# EAGLE schematic Nu_Preamp (EAGLE 6.3)
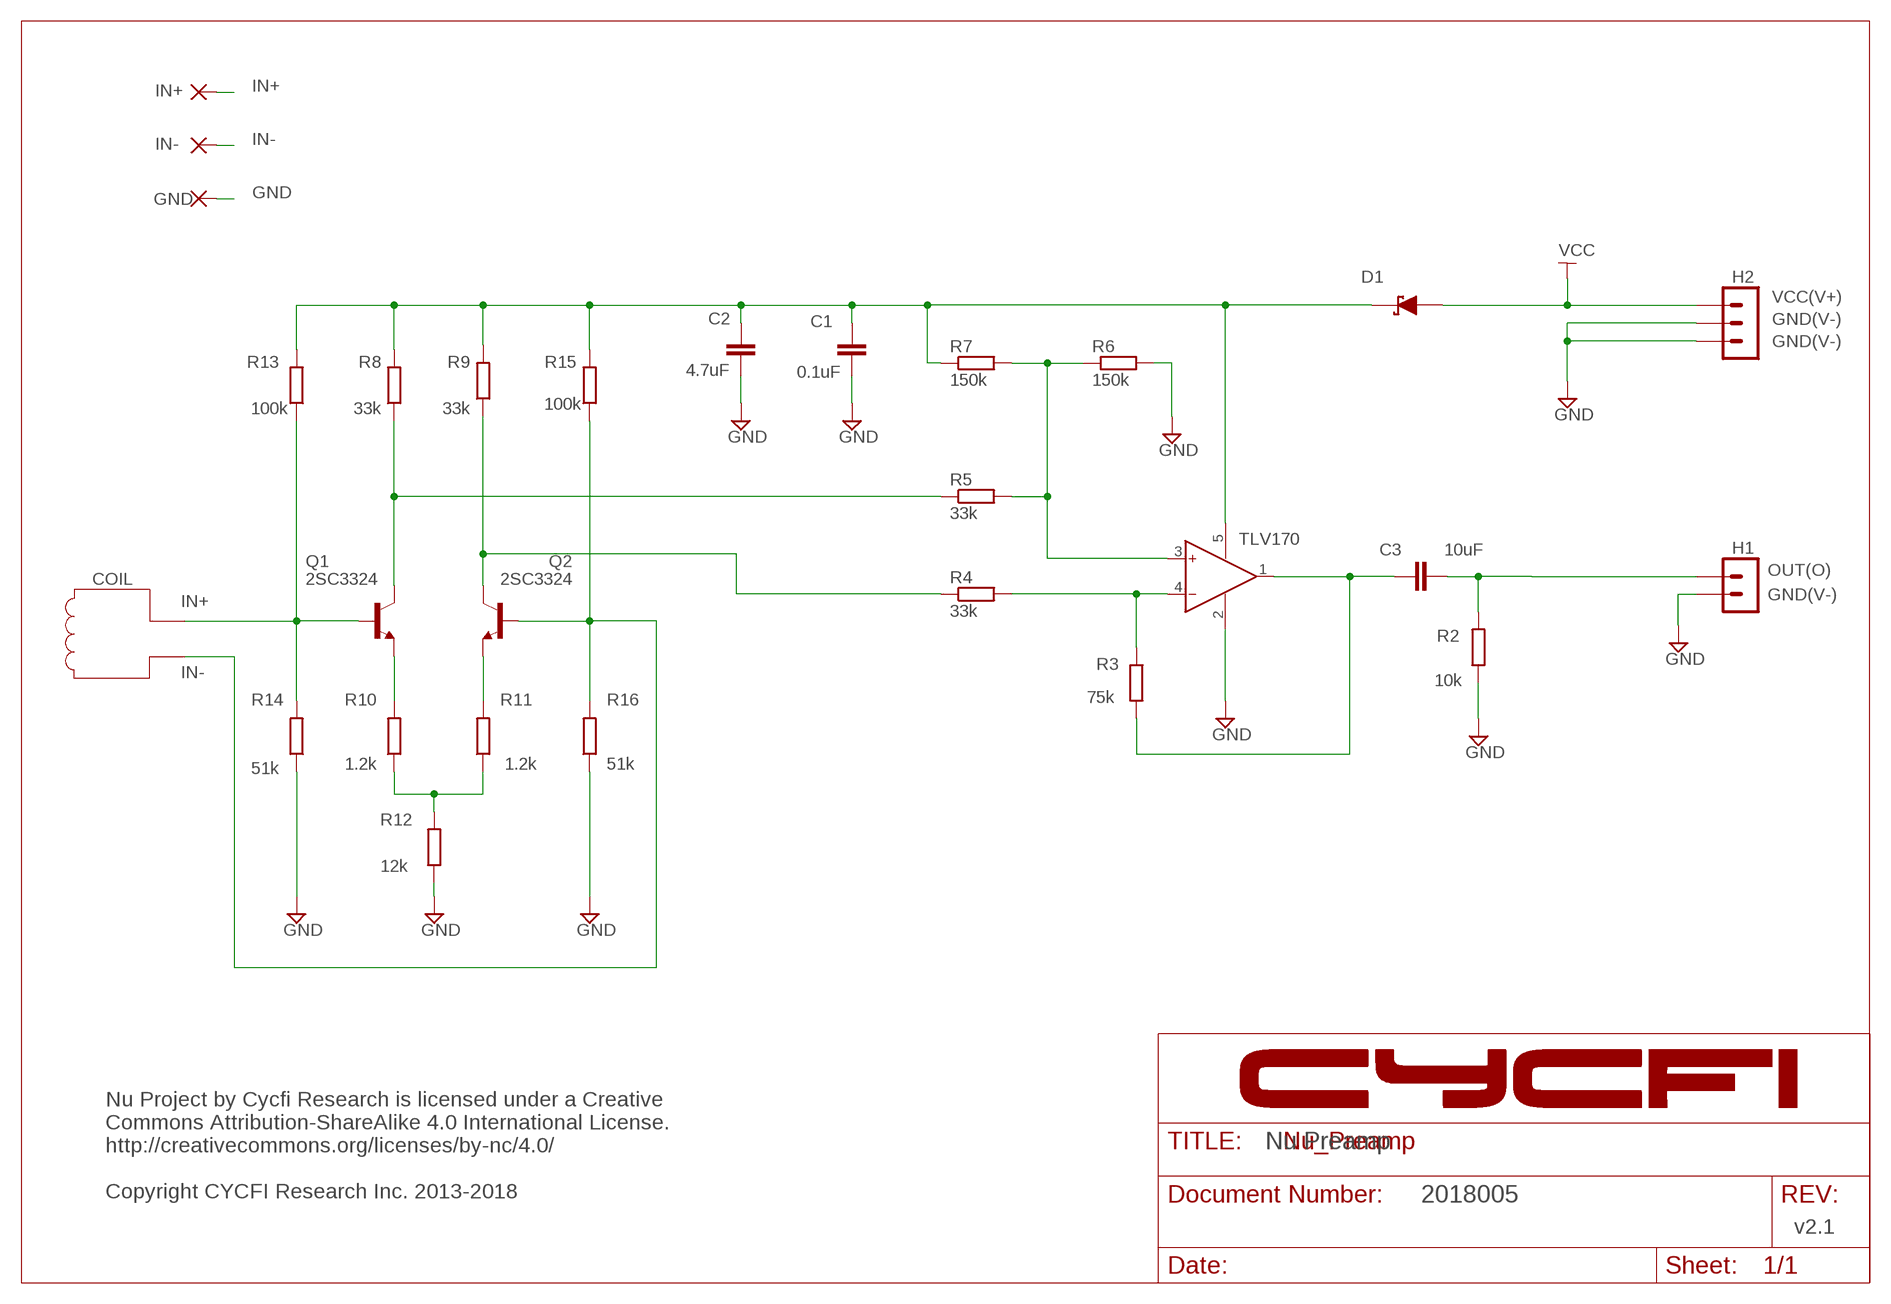
[diagram p0: schematic, sheet 1]

## Parts
C1  0.1uF  C-EUC0402  [C0402]
C2  4.7uF  C0603_NK  [C0603_NK]
C3  10uF  C0603_NK  [C0603_NK]
D1  D_SCHOTTKYL  [SOD-323]
GND  SMD2  [SMD1,27-2,54]
H1  2P-2MM-TH-MALE  [2P-2MM-TH]
H2  3P-2MM-TH-MALE  [3P-2MM-TH]
IN+  SMD2  [SMD1,27-2,54]
IN-  SMD2  [SMD1,27-2,54]
Q1  2SC3324  [SOT23]
Q2  2SC3324  [SOT23]
R2  10k  R-EU_R0402  [R0402]
R3  75k  R-EU_R0402  [R0402]
R4  33k  R-EU_R0402  [R0402]
R5  33k  R-EU_R0402  [R0402]
R6  150k  R-EU_R0402  [R0402]
R7  150k  R-EU_R0402  [R0402]
R8  33k  R-EU_R0402  [R0402]
R9  33k  R-EU_R0402  [R0402]
R10  1.2k  R-EU_R0402  [R0402]
R11  1.2k  R-EU_R0402  [R0402]
R12  12k  R-EU_R0402  [R0402]
R13  100k  R-EU_R0402  [R0402]
R14  51k  R-EU_R0402  [R0402]
R15  100k  R-EU_R0402  [R0402]
R16  51k  R-EU_R0402  [R0402]
U1  TLV170  [SOT23-5]

## Nets
GND: C1.2 C2.1 GND.1(P) H1.P$2 H2.P$2 H2.P$3 R2.1 R6.2 R12.1 R14.1 R16.1 U1.2(V-)
IN+: IN+.1(P) Q1.1(B) R13.1 R14.2
IN-: IN-.1(P) Q2.1(B) R15.1 R16.2
N$1: C3.2 H1.P$1 R2.2
N$5: Q1.3(C) R5.1 R8.1
N$6: Q2.3(C) R4.1 R9.1
N$9: Q1.2(E) R10.2
N$10: Q2.2(E) R11.2
N$13: R10.1 R11.1 R12.2
N$14: R5.2 R6.1 R7.2 U1.3(IN+)
N$15: R3.2 R4.2 U1.4(IN-)
N$16: C3.1 R3.1 U1.1(OUT)
N$19: D1.1(A) H2.P$1
VCC1: C1.1 C2.2 D1.2(C) R7.1 R8.2 R9.2 R13.2 R15.2 U1.5(V+)

## Notes on the sheet
- VCC
- VCC(V+)
- GND(V-)
- GND(V-)
- OUT(O)
- COIL
- GND(V-)
- IN+
- IN-
- Nu Preamp
- Nu Project by Cycfi Research is licensed under a Creative 
  Commons Attribution-ShareAlike 4.0 International License. 
  http://creativecommons.org/licenses/by-nc/4.0/
  
  Copyright CYCFI Research Inc. 2013-2018
- 2018005
- v2.1

## Library data of the parts
C1 = rcl:C-EU: CAPACITOR, European symbol
C2 C3 = rcl:C0603_NK
D1 = m-pad-2.1:D_SCHOTTKY: Schottky diodes in various packages
GND IN+ IN- = wirepad:SMD2: SMD PAD
H1 = CYCFI_Con:2P-2MM-TH-MALE
H2 = CYCFI_Con:3P-2MM-TH-MALE
Q1 Q2 = CYCFI_semicon:2SC3324
R2 R8-R16 = rcl:R-EU_: RESISTOR, European symbol
R3-R7 = resistor:R-EU_: RESISTOR, European symbol
U1 = CYCFI_semicon:TLV170